# EAGLE design esp8266 (EAGLE 7.5.0)
CNAME: MiniElektro Denmark; CREVISION: 0 #1616; DESIGNER: By: NWYKE
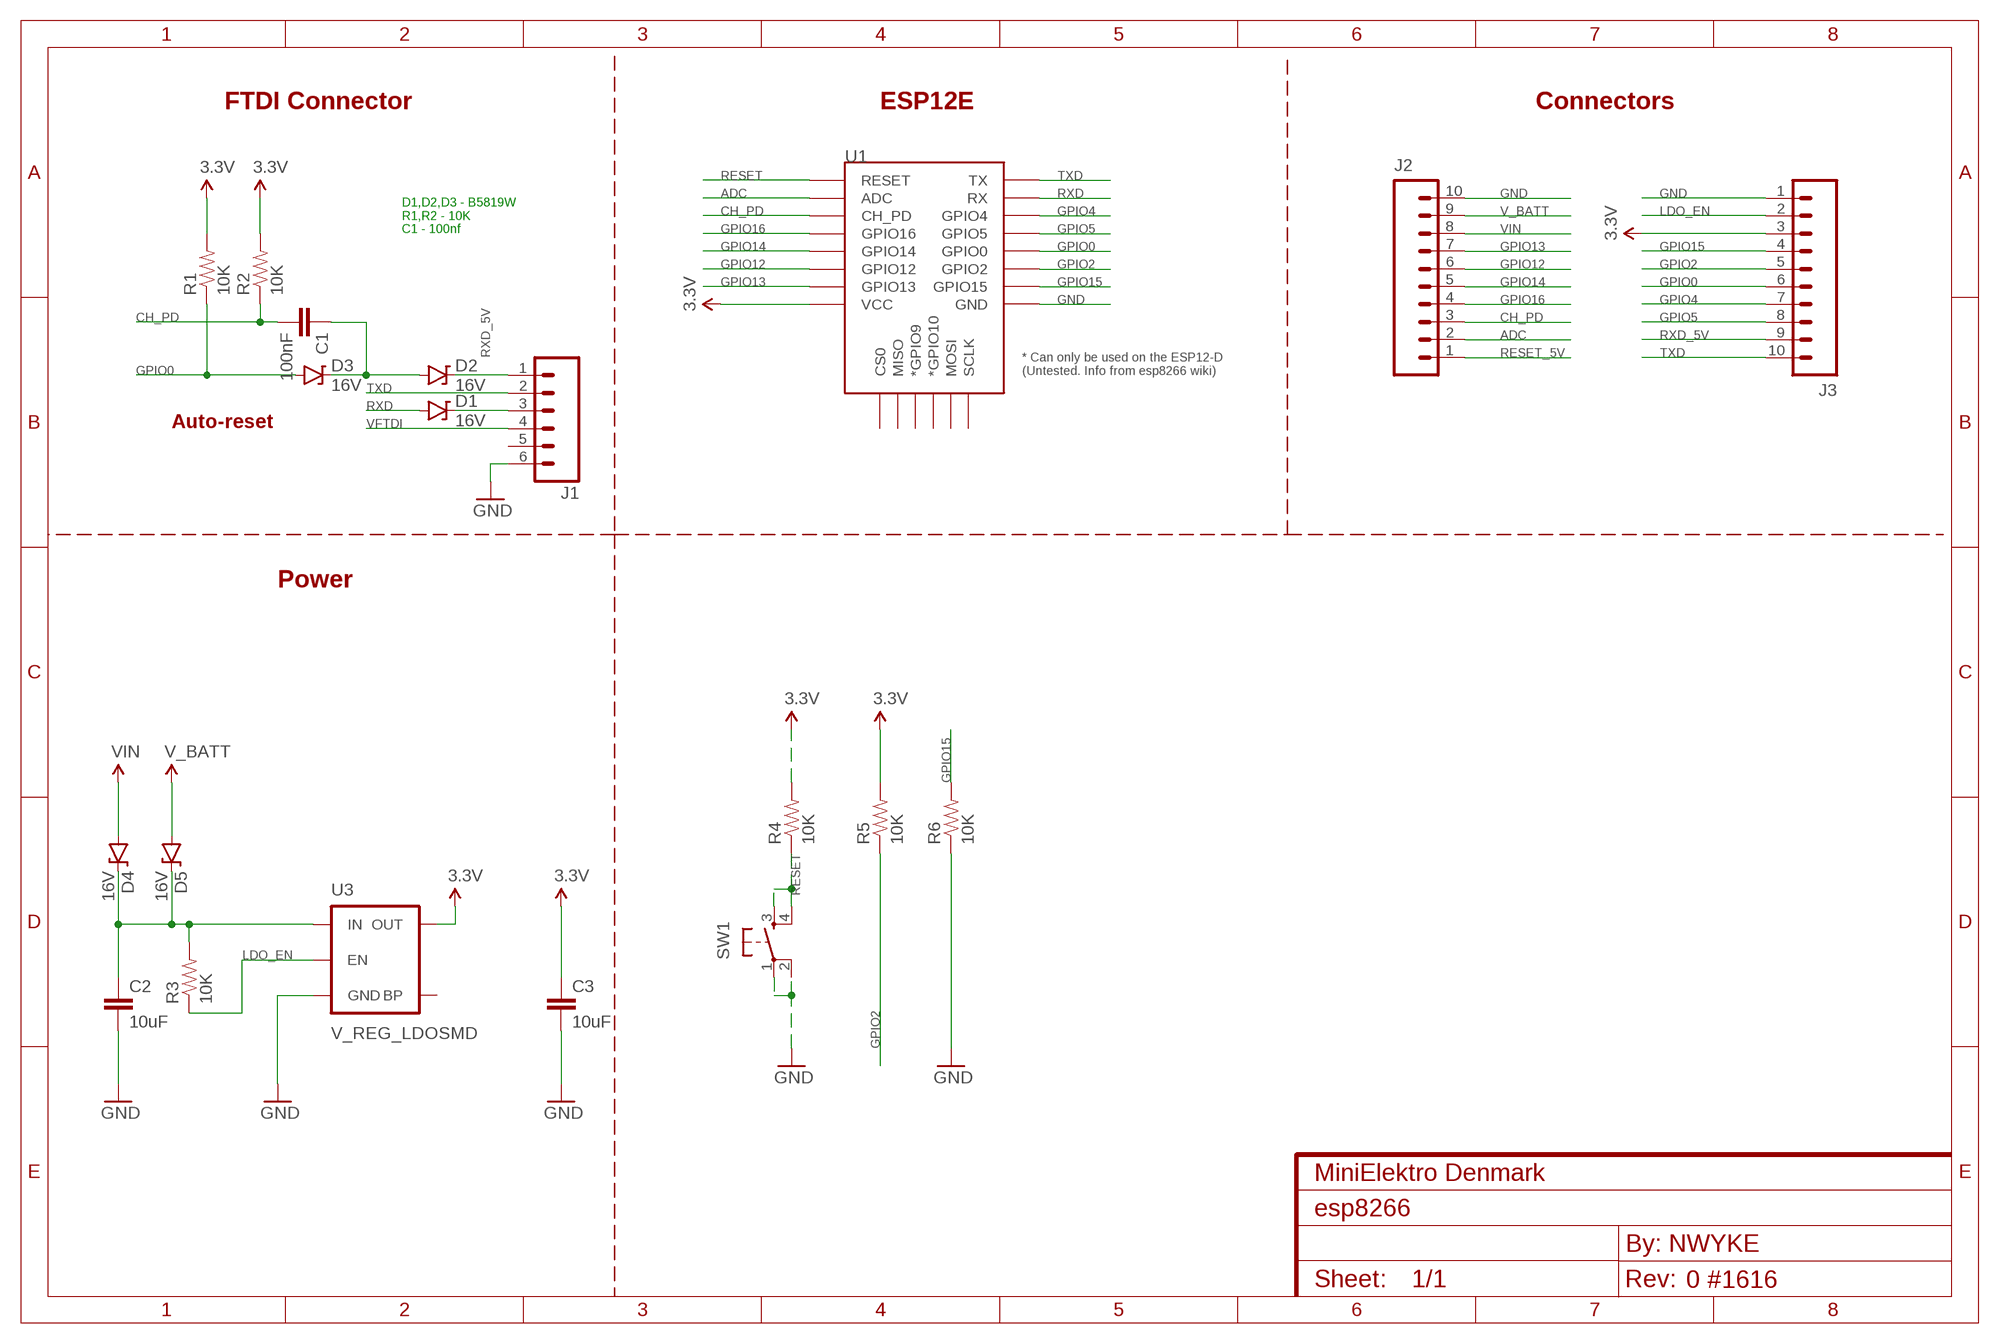
[diagram p0: schematic, sheet 1]

## Parts
C1  100nF  CAP0402-CAP  [0402-CAP]
C2  10uF  CAP0402-CAP  [0402-CAP]
C3  10uF  CAP0402-CAP  [0402-CAP]
D1  16V  DIODE-ZENER16V  [SOD-123]
D2  16V  DIODE-ZENER16V  [SOD-123]
D3  16V  DIODE-ZENER16V  [SOD-123]
D4  16V  DIODE-ZENER16V  [SOD-123]
D5  16V  DIODE-ZENER16V  [SOD-123]
J1  M06SILK_FEMALE_PTH  [1X06]
J2  M10SILK_FEMALE_PTH  [1X10]
J3  M10SILK_FEMALE_PTH  [1X10]
R1  10K  RESISTOR0402-RES  [0402-RES]
R2  10K  RESISTOR0402-RES  [0402-RES]
R3  10K  RESISTOR0402-RES  [0402-RES]
R4  10K  RESISTOR0402-RES  [0402-RES]
R5  10K  RESISTOR0402-RES  [0402-RES]
R6  10K  RESISTOR0402-RES  [0402-RES]
SW1  SWITCH_SPST_4_PINRECT  [TACTILE_SWITCH_SMD_4.6X2.8MM]
U1  ESP12ESMD  [ESP12E-SMD]
U3  V_REG_LDOSMD  [SOT23-5]

## Nets
3.3V: C3.1 J3.3 R1.2 R2.2 R4.2 R5.2 U1.VCC U3.5(OUT)
ADC: J2.2 U1.ADC
CH_PD: C1.2 J2.3 R2.1 U1.CH_PD
GND: C2.2 C3.2 J1.6 J2.10 J3.1 R6.1 SW1.1 SW1.2 U1.GND U3.2(GND)
GPIO0: D3.A J3.6 R1.1 U1.GPIO0
GPIO2: J3.5 R5.1 U1.GPIO2
GPIO4: J3.7 U1.GPIO4
GPIO5: J3.8 U1.GPIO5
GPIO12: J2.6 U1.GPIO12
GPIO13: J2.7 U1.GPIO13
GPIO14: J2.5 U1.GPIO14
GPIO15: J3.4 R6.2 U1.GPIO15
GPIO16: J2.4 U1.GPIO16
LDO_EN: J3.2 R3.1 U3.3(EN)
N$1: C2.1 D4.C D5.C R3.2 U3.1(IN)
N$2: D2.C J1.1
N$3: C1.1 D2.A D3.C
RESET: R4.1 SW1.3 SW1.4 U1.RESET
RESET_5V: J2.1
RXD: D1.A U1.RXD0(RX)
RXD_5V: D1.C J1.3 J3.9
TXD: J1.2 J3.10 U1.TXD0(TX)
V_BATT: D5.A J2.9
VFTDI: J1.4
VIN: D4.A J2.8
Unconnected: J1.5 U1.CS0 U1.GPIO9(*GPIO9) U1.GPIO10(*GPIO10) U1.MISO U1.MOSI U1.SCLK U3.4(BP)

## Notes on the sheet
- FTDI Connector | ESP12E | Connectors
- D1,D2,D3 - B5819W
  R1,R2 - 10K
  C1 - 100nf
- Auto-reset
- Power

## Library data of the parts
C1-C3 = SparkFun-Passives:CAP: Capacitor Standard 0603 ceramic capacitor, and 0.1" leaded capacitor.
D1-D5 = SparkFun-DiscreteSemi:DIODE-ZENER: Zener Diode Production Part - 8199 3.4V Zener Voltage; PROD_ID: DIO-12440
J1 = SparkFun-Connectors:M06: Header 6 Standard 6-pin 0.1" header. Use with straight break away headers (SKU : PRT-00116), right angle break away headers (PRT-00553), swiss pins (PRT-00743), machine pins (PRT-00117), and female headers (PRT-00115). Molex polarized connector foot print use with SKU : PRT-08094 with associated crimp pins and housings. NOTES ON THE VARIANTS LOCK and LOCK_LONGPADS... This footprint was designed to help hold the alignment of a through-hole component (i.e. 6-pin header) while soldering it into place. You may notice that each hole has been shifted either up or down by 0.005 of an inch from it's more standard position (which is a perfectly straight line). This slight alteration caused the pins (the squares in the middle) to touch the edges of the holes. Because they are alternating, it causes a "brace" to hold the component in place. 0.005 has proven to be the perfect amount of "off-center" position when using our standard breakaway headers. Although looks a little odd when you look at the bare footprint, once you have a header in there, the alteration is very hard to notice. Also,if you push a header all the way into place, it is covered up entirely on the bottom side. This idea of altering the position of holes to aid alignment will be further integrated into the Sparkfun Library for other footprints. It can help hold any component with 3 or more connection pins.; PROD_ID: CONN-08437
J2 J3 = SparkFun-Connectors:M10: Header 10 Standard 10-pin 0.1" header. Use with straight break away headers (SKU : PRT-00116), right angle break away headers (PRT-00553), swiss pins (PRT-00743), machine pins (PRT-00117), and female headers (PRT-00115).; PROD_ID: CONN-11563
R1-R6 = SparkFun-Passives:RESISTOR: Resistor Basic schematic elements and footprints for 0603, 1206, and PTH resistors.
SW1 = SparkFun-Electromechanical:SWITCH_SPST_4_PIN; PROD_ID: SWCH-13065
U1 = esp8266modules:ESP12E: ESP12E Module
U3 = SparkFun-PowerIC:V_REG_LDO: Voltage Regulator LDO Standard 150mA LDO voltage regulator in SOT-23 layout. Micrel part MIC5205. BP (by-pass) pin is used to lower output noise with 470pF cap.

## Board
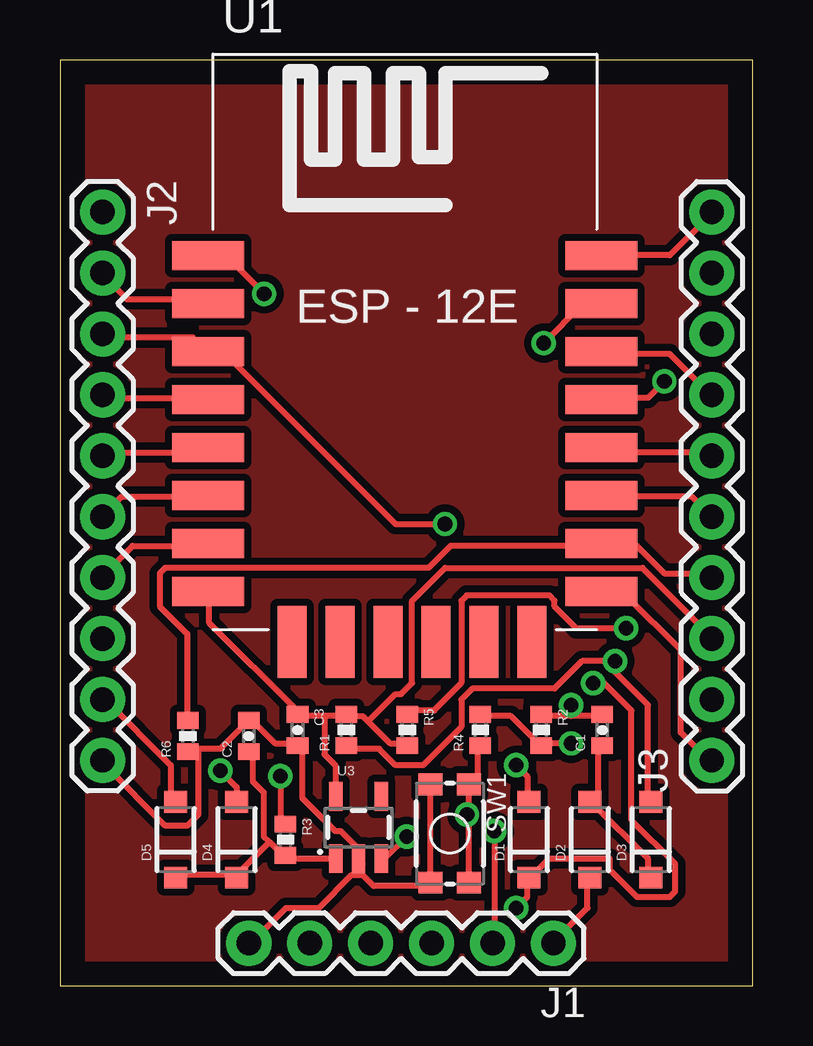
[diagram p1: board, top side]
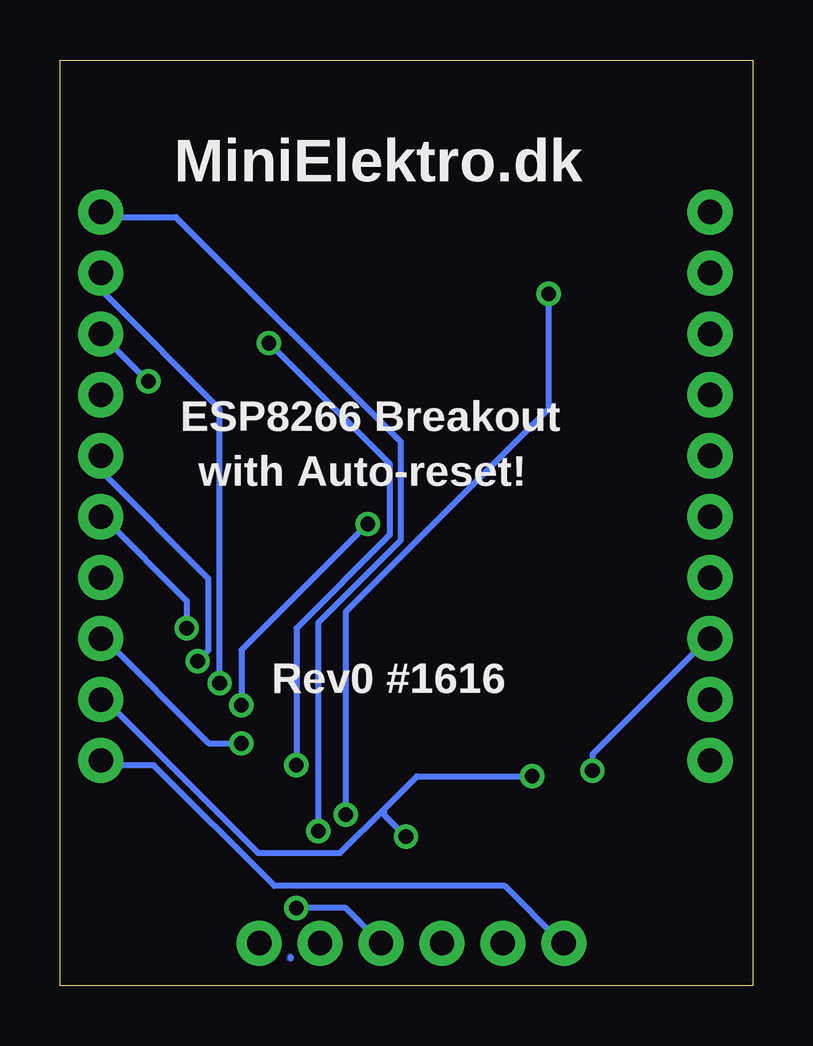
[diagram p2: board, bottom side, seen from below]

Size 28.88 x 38.6 mm. Coordinates in mm from the lower left corner, seen from the top.
Outline: 0,0 28.88,0 28.88,38.6 0,38.6 0,0
Copper layers (1*16): Top 0.035mm / dielectric 1.5mm / Bottom 0.035mm
Design rules "default": minimum track width 10mil, minimum drill 24mil, track to track 8mil, track to pad 8mil, pad to pad 8mil, via to via 8mil, smd to smd 8mil, copper to edge 40mil, drill to drill 8mil, minimum pad ring 10mil, minimum via ring 8mil, stop-mask expansion 4mil, vias tented up to drill 0mil, thermal gap 10mil

### Footprints (pad centres in the part's own frame; a part is rotated, then mirrored left to right if it is on the bottom)
0402-CAP = smd 0.7 x 0.9: 1 -0.65,0; 2 0.65,0
SOD-123 = smd 0.9 x 0.95: A 1.575,0; C -1.575,0
1X06 = drill 1.016 pad 1.88: 1 0,0; 2 2.54,0; 3 5.08,0; 4 7.62,0; 5 10.16,0; 6 12.7,0
1X10 = drill 1.016 pad 1.88: 1 0,0; 2 2.54,0; 3 5.08,0; 4 7.62,0; 5 10.16,0; 6 12.7,0; 7 15.24,0; 8 17.78,0; 9 20.32,0; 10 22.86,0
0402-RES = smd 0.7 x 0.9: 1 -0.65,0; 2 0.65,0
TACTILE_SWITCH_SMD_4.6X2.8MM = smd 0.9 x 1: 1 -2.05,-0.8; 2 2.05,-0.8; 3 2.05,0.8; 4 -2.05,0.8
ESP12E-SMD = smd 3 x 1.2: ADC -8.3,3.8; CH_PD -8.3,1.8; GND 8.1,-8.2; GPIO0 8.1,-2.2; GPIO2 8.1,-4.2; GPIO4 8.1,1.8; GPIO5 8.1,-0.2; GPIO12 -8.3,-4.2; GPIO13 -8.3,-6.2; GPIO14 -8.3,-2.2; GPIO15 8.1,-6.2; GPIO16 -8.3,-0.2; RESET -8.3,5.8; RXD0 8.1,3.8; TXD0 8.1,5.8; VCC -8.3,-8.2 | smd 1.2 x 3: CS0 -4.8,-10.3; GPIO9 -0.8,-10.3; GPIO10 1.2,-10.3; MISO -2.8,-10.3; MOSI 3.2,-10.3; SCLK 5.2,-10.3
SOT23-5 = smd 0.55 x 1.2: 1 -0.95,-1.3; 2 0,-1.3; 3 0.95,-1.3; 4 0.95,1.3; 5 -0.95,1.3

### Placement (x,y rotation side)
C1  22.61,10.67 90 top
C2  7.87,10.41 90 top
C3  9.91,10.67 270 top
D1  19.56,6.1 90 top
D2  22.1,6.1 90 top
D3  24.64,6.1 90 top
D4  7.37,6.1 90 top
D5  4.83,6.1 90 top
J1  20.57,1.78 180 top
J2  1.78,32.26 270 top
J3  27.18,9.4 90 top
R1  11.94,10.67 90 top
R2  20.07,10.67 270 top
R3  9.4,6.1 270 top
R4  17.53,10.67 90 top
R5  14.48,10.67 270 top
R6  5.33,10.41 90 top
SW1  16.26,6.35 270 top
U1  14.48,24.64 0 top
U3  12.45,6.6 0 top

### Tracks (layer width: path | path; a pad name or v marks a point on that pad's centre or on a via)
3.3V  (via drill 0.61)
  Top 0.254: R4.2 17.65,11.25 18.8,11.25 19.94,10.11 R2.2 20.17,10.11 v21.31,10.11 | 11.94,11.25 11.02,11.25 | 11.02,11.25 10.11,11.25 C3.1 9.88,11.48 6.22,15.14 6.22,16.28 U1.VCC | 12.85,11.02 12.62,11.25 11.94,11.25 | 12.85,11.02 13.77,10.11 14.45,10.11 R5.2 | 11.94,11.25 R1.2 | 11.02,11.25 11.02,9.65 11.48,9.2 11.48,8.05 U3.5 | 12.85,11.02 14,12.17 14.22,12.17 14.68,12.62 14.68,16.05 16.05,17.42 24.28,17.42 27.03,14.68 J3.3
  Bottom 0.254: v21.31,10.11 22.68,10.11 27.03,14.45 J3.3
ADC
  Top 0.254: U1.ADC 5.99,28.63 2.79,28.63 1.88,29.54 J2.2
CH_PD  (via drill 0.61)
  Top 0.254: 21.31,11.25 22.45,11.25 C1.2 | 21.31,11.25 20.17,11.25 R2.1 | v21.31,11.71 21.31,11.25 | v16.05,19.25 14,19.25 6.91,26.34 6.22,26.34 U1.CH_PD 5.99,26.57 5.54,27.03 1.88,27.03 J2.3
  Bottom 0.254: v21.31,11.71 21.31,14 v16.05,19.25
GND
  Top 0.254: SW1.1 SW1.2 15.37,4.17 13.08,4.17 12.62,4.62 | U1.GND 22.68,16.28 23.6,16.28 25.88,14 25.88,10.57 27.03,9.42 J3.1 | 5.77,9.88 6.68,9.88 7.82,11.02 C2.2 8.05,11.02 8.97,10.11 9.88,10.11 C3.2 10.11,9.88 10.11,7.82 11.48,6.45 11.71,6.45 12.39,5.77 12.39,5.31 U3.2 12.62,5.08 12.62,4.62 | 5.77,9.88 5.54,9.88 R6.1 5.77,9.88 | 12.62,4.62 12.17,4.62 10.8,3.25 9.42,3.25 8.05,1.88 J1.6 | 5.77,9.88 5.77,7.14 5.31,6.68 4.39,6.68 1.88,9.2 J2.10
  Bottom 0.254: J3.1 27.03,9.2 24.97,9.2 19.94,4.17 10.34,4.17 8.05,1.88 J1.6
GPIO0  (via drill 0.61)
  Top 0.254: U1.GPIO0 22.68,22.22 27.03,22.22 J3.6 | 22.91,13.31 24.51,11.71 24.51,7.82 D3.A | 22.91,13.31 22.68,13.54 21.77,13.54 20.62,12.39 17.2,12.39 16.74,11.94 16.74,10.8 15.14,9.2 14,9.2 13.31,9.88 11.94,9.88 R1.1 | 22.91,13.31 v23.14,13.54
  Bottom 0.254: v23.14,13.54 22.68,14 22.68,16.97 27.03,21.31 27.03,22 J3.6
GPIO2  (via drill 0.61)
  Top 0.254: v23.6,14.91 21.54,14.91 20.62,15.82 20.62,16.05 20.4,16.28 16.97,16.28 16.74,16.05 16.74,12.62 15.6,11.48 14.68,11.48 R5.1 | J3.5 26.34,20.4 22.68,20.4 U1.GPIO2
  Bottom 0.254: v23.6,14.91 23.6,16.05 27.03,19.48 J3.5
GPIO4
  Top 0.254: U1.GPIO4 22.68,26.34 25.43,26.34 27.03,24.74 J3.7
GPIO5  (via drill 0.61)
  Top 0.254: v25.2,25.2 24.51,24.51 22.68,24.51 U1.GPIO5
  Bottom 0.254: J3.8 v25.2,25.2
GPIO12
  Top 0.254: U1.GPIO12 5.99,20.4 2.56,20.4 1.88,19.71 J2.6
GPIO13
  Top 0.254: U1.GPIO13 5.99,18.34 3.02,18.34 1.88,17.2 J2.7
GPIO14
  Top 0.254: U1.GPIO14 5.99,22.22 1.88,22.22 J2.5
GPIO15
  Top 0.254: R6.2 5.31,11.25 5.31,14.68 4.17,15.82 4.17,17.2 4.39,17.42 15.37,17.42 16.28,18.34 22.45,18.34 U1.GPIO15 22.68,18.34 24.05,18.34 25.2,17.2 27.03,17.2 J3.4
GPIO16
  Top 0.254: U1.GPIO16 5.99,24.51 1.88,24.51 J2.4
LDO_EN  (via drill 0.61)
  Top 0.254: v9.2,8.74 9.2,6.91 R3.1 | v14.45,6.22 13.54,5.31 U3.3
  Bottom 0.254: v9.2,8.74 14,8.74 15.37,7.37 | 15.37,7.37 17.2,5.54 20.62,5.54 27.03,11.94 J3.2 | v14.45,6.22 15.37,7.14 15.37,7.37
N$1
  Top 0.254: 7.37,4.62 4.85,4.62 D5.C | 8.74,5.99 9.2,5.54 R3.2 9.42,5.31 11.48,5.31 U3.1 | 8.74,5.99 8.51,6.22 8.51,8.05 8.05,8.51 8.05,9.65 C2.1 | 8.74,5.99 7.37,4.62 | 7.37,4.62 D4.C
N$2
  Top 0.254: D2.C 22,4.39 22,3.25 20.62,1.88 J1.1
N$3
  Top 0.254: C1.1 22.45,9.88 22.45,8.05 22.22,7.82 D2.A 22.22,7.59 24.51,5.31 24.51,4.62 D3.C
N$4
  Bottom 0.254: 19.25,1.19 19.26,1.14
  pour Bottom (isolate 0.305): 0,0 0,38.61 28.96,38.61 28.96,0
N$5
  pour Top (isolate 0.305): 0,0 0,38.61 28.96,38.61 28.96,0
RESET  (via drill 0.61)
  Top 0.254: SW1.3 17.06,7.14 | 17.06,7.14 SW1.4 17.2,8.51 17.42,8.74 17.42,9.88 R4.1 | v8.51,28.85 7.14,30.23 6.22,30.23 U1.RESET | v16.97,7.14 17.06,7.14
  Bottom 0.254: v16.97,7.14 16.97,15.6 8.51,24.05 v8.51,28.85
RXD  (via drill 0.61)
  Top 0.254: v19.02,9.2 19.48,8.74 19.48,7.82 D1.A | v20.17,26.8 21.77,28.4 22.45,28.4 U1.RXD0
  Bottom 0.254: v19.02,9.2 19.02,14.91 15.14,18.8 15.14,21.77 v20.17,26.8
RXD_5V  (via drill 0.61)
  Top 0.254: v19.02,3.25 19.48,3.71 19.48,4.39 D1.C 19.71,4.62 20.4,5.31 22.91,5.31 22.91,4.85 24.05,3.71 25.43,3.71 25.65,3.94 25.65,5.08 23.82,6.91 23.82,11.48 22.68,12.62 v22.22,12.62
  Bottom 0.254: v19.02,3.25 16.97,3.25 J1.3 | v22.22,12.62 22.22,24.05 27.03,28.85 27.03,29.54 J3.9
TXD  (via drill 0.61)
  Top 0.254: U1.TXD0 22.68,30.45 25.43,30.45 27.03,32.05 J3.10 | v18.11,6.45 18.11,1.88 J1.2
  Bottom 0.254: v18.11,6.45 18.11,15.14 14.68,18.57 14.68,22.68 24.05,32.05 27.03,32.05 J3.10
V_BATT
  Top 0.254: D5.A 4.62,7.82 4.62,9.2 1.88,11.94 J2.9
VIN  (via drill 0.61)
  Top 0.254: D4.A 7.37,8.28 v6.68,8.97
  Bottom 0.254: v6.68,8.97 6.68,9.65 1.88,14.45 J2.8

### Text on the board
bPlace: MiniElektro.dk | ESP8266 Breakout | with Auto-reset! | Rev0 #1616